# Altium schematic sheet Sheet1.SchDoc: 50Hz Notch And LP Filter
size A4; ApprovedBy: Matej Gomboc; CheckedBy: Matej Gomboc; Author: Matej Gomboc; DrawnBy: Matej Gomboc; Engineer: Matej Gomboc; DocumentNumber: 1; Revision: 1.0; SheetNumber: 1; SheetTotal: 1; ProjectName: 50Hz Notch And LP Filter
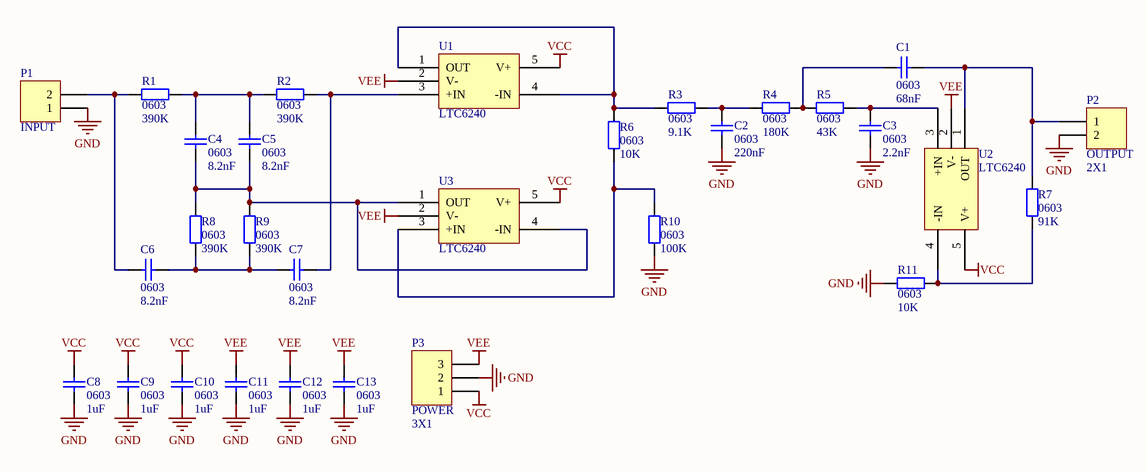
[diagram p0: Sheet1.SchDoc]

## Parts
C1  0603  value 68nF  [J1-0603]
C2  0603  value 220nF  [J1-0603]
C3  0603  value 2.2nF  [J1-0603]
C4  0603  value 8.2nF  [J1-0603]
C5  0603  value 8.2nF  [J1-0603]
C6  0603  value 8.2nF  [J1-0603]
C7  0603  value 8.2nF  [J1-0603]
C8  0603  value 1uF  [J1-0603]
C9  0603  value 1uF  [J1-0603]
C10  0603  value 1uF  [J1-0603]
C11  0603  value 1uF  [J1-0603]
C12  0603  value 1uF  [J1-0603]
C13  0603  value 1uF  [J1-0603]
P1  INPUT  [HDR1X2]
P2  OUTPUT  value 2X1  [HDR1X2]
P3  POWER  value 3X1  [HDR1X3]
R1  0603  value 390K  [1608[0603]]
R2  0603  value 390K  [1608[0603]]
R3  0603  value 9.1K  [1608[0603]]
R4  0603  value 180K  [1608[0603]]
R5  0603  value 43K  [1608[0603]]
R6  0603  value 10K  [1608[0603]]
R7  0603  value 91K  [1608[0603]]
R8  0603  value 390K  [1608[0603]]
R9  0603  value 390K  [1608[0603]]
R10  0603  value 100K  [1608[0603]]
R11  0603  value 10K  [1608[0603]]
U1  LTC6240  [LTC6240_SOT23]
U2  LTC6240  [LTC6240_SOT23]
U3  LTC6240  [LTC6240_SOT23]

## Nets
GND: C2.1 C3.1 C8.2 C9.2 C10.2 C11.2 C12.2 C13.2 P1.1 P2.2 P3.2 R10.2 R11.1
VCC: C8.1 C9.1 C10.1 P3.1 U1.5(V+) U2.5(V+) U3.5(V+)
VEE: C11.1 C12.1 C13.1 P3.3 U1.2(V-) U2.2(V-) U3.2(V-)
NetC1_1: C1.1 P2.1 R7.1 U2.1(OUT)
NetC1_2: C1.2 R4.1 R5.2
NetC2_2: C2.2 R3.1 R4.2
NetC3_2: C3.2 R5.1 U2.3(+IN)
NetC4_1: C4.1 C5.1 R8.1 R9.1 U3.1(OUT) U3.4(-IN)
NetC4_2: C4.2 C5.2 R1.2 R2.1
NetC6_1: C6.1 C7.2 R8.2 R9.2
NetC6_2: C6.2 P1.2 R1.1
NetC7_1: C7.1 R2.2 U1.3(+IN)
NetR3_2: R3.2 R6.2 U1.1(OUT) U1.4(-IN)
NetR6_1: R6.1 R10.1 U3.3(+IN)
NetR7_2: R7.2 R11.2 U2.4(-IN)

## Library data of the parts
C1-C13 = Cap: Capacitor
P1 P2 = Header 2: Header, 2-Pin
P3 = Header 3: Header, 3-Pin
R1-R11 = Res2: Resistor
U1-U3 = LTC6240: low noise jfet opamp